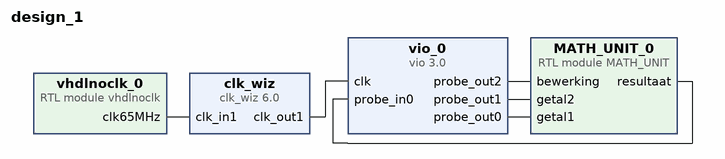
[diagram p0: block diagram of the top level]
# Vivado block design design_1, xc7z007sclg225-1, Vivado 2018.2
create_bd_design design_1

create_bd_cell -type module -reference MATH_UNIT MATH_UNIT_0
create_bd_cell -type ip -vlnv xilinx.com:ip:vio:3.0 vio_0
set_property -dict [list \
  CONFIG.C_PROBE_OUT2_WIDTH 3 \
  CONFIG.C_PROBE_OUT1_WIDTH 32 \
  CONFIG.C_PROBE_OUT0_WIDTH 32 \
  CONFIG.C_NUM_PROBE_OUT 3 \
  CONFIG.C_NUM_PROBE_IN 1 \
] [get_bd_cells vio_0]
create_bd_cell -type ip -vlnv xilinx.com:ip:clk_wiz:6.0 clk_wiz
set_property -dict [list \
  CONFIG.PRIMITIVE MMCM \
  CONFIG.PRIM_IN_FREQ 65 \
  CONFIG.USE_INCLK_SWITCHOVER false \
  CONFIG.SECONDARY_SOURCE Single_ended_clock_capable_pin \
  CONFIG.CLKIN1_JITTER_PS 153.84 \
  CONFIG.CLKIN2_JITTER_PS 112.49000000000001 \
  CONFIG.PRIM_SOURCE No_buffer \
  CONFIG.CLKOUT1_DRIVES BUFG \
  CONFIG.CLKOUT2_DRIVES BUFG \
  CONFIG.CLKOUT3_DRIVES BUFG \
  CONFIG.CLKOUT4_DRIVES BUFG \
  CONFIG.CLKOUT5_DRIVES BUFG \
  CONFIG.CLKOUT6_DRIVES BUFG \
  CONFIG.CLKOUT7_DRIVES BUFG \
  CONFIG.FEEDBACK_SOURCE FDBK_AUTO \
  CONFIG.USE_LOCKED false \
  CONFIG.USE_RESET false \
  CONFIG.MMCM_DIVCLK_DIVIDE 1 \
  CONFIG.MMCM_CLKFBOUT_MULT_F 15.000 \
  CONFIG.MMCM_CLKIN1_PERIOD 15.385 \
  CONFIG.MMCM_CLKIN2_PERIOD 10.0 \
  CONFIG.MMCM_COMPENSATION ZHOLD \
  CONFIG.MMCM_CLKOUT0_DIVIDE_F 9.750 \
  CONFIG.CLKOUT1_JITTER 147.748 \
  CONFIG.CLKOUT1_PHASE_ERROR 109.791 \
] [get_bd_cells clk_wiz]
create_bd_cell -type module -reference vhdlnoclk vhdlnoclk_0

# ---- connections ----

connect_bd_net [get_bd_pins clk_wiz/clk_out1] [get_bd_pins vio_0/clk]
connect_bd_net [get_bd_pins MATH_UNIT_0/resultaat] [get_bd_pins vio_0/probe_in0]
connect_bd_net [get_bd_pins vio_0/probe_out2] [get_bd_pins MATH_UNIT_0/bewerking]
connect_bd_net [get_bd_pins vio_0/probe_out1] [get_bd_pins MATH_UNIT_0/getal2]
connect_bd_net [get_bd_pins vio_0/probe_out0] [get_bd_pins MATH_UNIT_0/getal1]
connect_bd_net [get_bd_pins vhdlnoclk_0/clk65MHz] [get_bd_pins clk_wiz/clk_in1]

validate_bd_design
save_bd_design
